# Altium schematic sheet Connectors.SchDoc
size A4; PageSetup: Record=PageOptions|CenterHorizontal=True|CenterVertical=True|PrintScale=1.00|XCorrection=1.00|YCorrection=1.00|PrintKind=0|BorderSize=5000000|LeftOffset=0|BottomOffset=0|Orientation=2|PaperLength=1000|PaperWidth=1000|Scale=100|PaperSource=7|PrintQuality=-3|MediaType=1|DitherType=10|PrintScaleMode=1|PaperKind=A4|PaperIndex=9
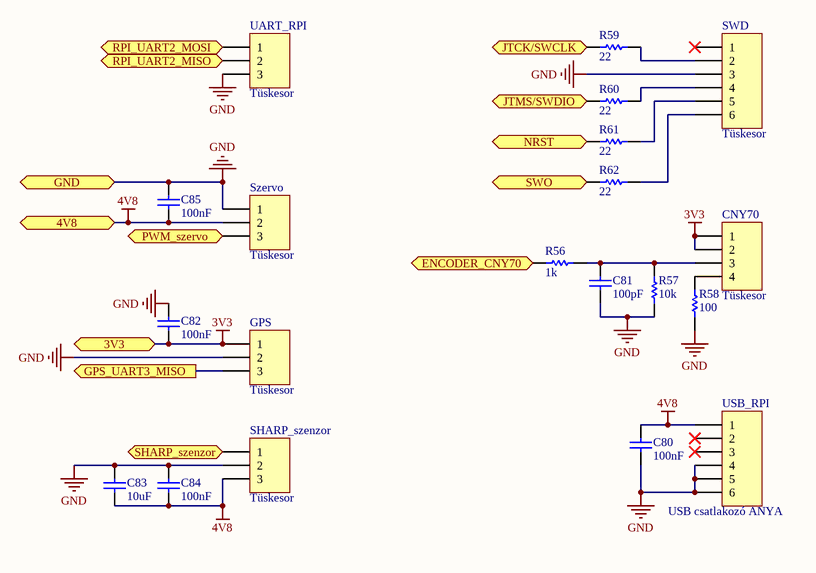
[diagram p0: Connectors.SchDoc]

## Parts
C80  value 100nF  [FP_0603_CAP_080]  (hidden comment: Cap)
C81  value 100pF  [FP_0603_CAP_080]  (hidden comment: Cap)
C82  value 100nF  [FP_0603_CAP_080]  (hidden comment: Cap)
C83  value 10uF  [FP_1206_CAP_125]  (hidden comment: Cap)
C84  value 100nF  [FP_0603_CAP_080]  (hidden comment: Cap)
C85  value 100nF  [FP_0603_CAP_080]  (hidden comment: Cap)
CNY70  Tüskesor  [FP_CONN4_TUSKE_254MM]
GPS  Tüskesor  [FP_CONN3_TUSKE_254MM]
R56  value 1k  [FP_0603_RES]  (hidden comment: Res1)
R57  value 10k  [FP_0603_RES]  (hidden comment: Res1)
R58  value 100  [FP_0603_RES]  (hidden comment: Res1)
R59  value 22  [FP_0603_RES]  (hidden comment: Res1)
R60  value 22  [FP_0603_RES]  (hidden comment: Res1)
R61  value 22  [FP_0603_RES]  (hidden comment: Res1)
R62  value 22  [FP_0603_RES]  (hidden comment: Res1)
SHARP_szenzor  Tüskesor  [HDR1X3]
SWD  Tüskesor  [HDR1X6]
Szervo  Tüskesor  [FP_CONN3_TUSKE_254MM]
UART_RPI  Tüskesor  [FP_CONN3_TUSKE_254MM]
USB_RPI  USB csatlakozó ANYA  [USB_vertical]

## Ports
3V3, 4V8, ENCODER_CNY70 (out), GND, GPS_UART3_MISO (out), JTCK/SWCLK (bidir), JTMS/SWDIO (bidir), NRST (bidir), PWM_szervo (in), RPI_UART2_MISO (out), RPI_UART2_MOSI (in), SHARP_szenzor (out), SWO (bidir)

## Nets
3V3: C82.1 CNY70.1 CNY70.2 GPS.1 ; port 3V3
4V8: C80.2 C83.2 C84.1 C85.1 SHARP_szenzor.3 Szervo.2 USB_RPI.1 ; port 4V8
GND: C80.1 C81.1 C82.2 C83.1 C84.2 C85.2 GPS.2 R57.1 R58.1 SHARP_szenzor.2 SWD.3 Szervo.1 UART_RPI.3 USB_RPI.4 USB_RPI.5 USB_RPI.6 ; port GND
ENCODER_CNY70: R56.2 ; port ENCODER_CNY70
GPS_UART3_MISO: GPS.3 ; port GPS_UART3_MISO
JTCK/SWCLK: R59.2 ; port JTCK/SWCLK
JTMS/SWDIO: R60.2 ; port JTMS/SWDIO
NRST: R61.2 ; port NRST
PWM_szervo: Szervo.3 ; port PWM_szervo
RPI_UART2_MISO: UART_RPI.2 ; port RPI_UART2_MISO
RPI_UART2_MOSI: UART_RPI.1 ; port RPI_UART2_MOSI
SHARP_szenzor: SHARP_szenzor.1 ; port SHARP_szenzor
SWO: R62.2 ; port SWO
NetC81_2: C81.2 CNY70.3 R56.1 R57.2
NetCNY70_4: CNY70.4 R58.2
NetR59_1: R59.1 SWD.2
NetR60_1: R60.1 SWD.4
NetR61_1: R61.1 SWD.5
NetR62_1: R62.1 SWD.6

Not connected (* = marked no-connect by the designer): SWD 1*; USB_RPI 2* 3*

## Library data of the parts
C80-C85 = Cap: Capacitor; Published: 8-Jun-2000; LatestRevisionDate: 17-Jul-2002; LatestRevisionNote: Re-released for DXP Platform.; PackageReference: RAD-0.3; Publisher: Altium Limited; PackageDescription: Radial Cap, Thru-Hole; 2 Leads; 0.3 in Pin Spacing
CNY70 = Header 4: Header, 4-Pin; LatestRevisionDate: 17-Jul-2002; LatestRevisionNote: Re-released for DXP Platform.; Publisher: Altium Limited
GPS SHARP_szenzor Szervo UART_RPI = Header 3: Header, 3-Pin; LatestRevisionDate: 17-Jul-2002; LatestRevisionNote: Re-released for DXP Platform.; Publisher: Altium Limited
R56-R62 = Res1: Resistor; Published: 8-Jun-2000; LatestRevisionDate: 17-Jul-2002; LatestRevisionNote: Re-released for DXP Platform.; PackageReference: AXIAL-0.3; Publisher: Altium Limited; PackageDescription: Axial Device, Thru-Hole; 2 Leads; 0.3 in Pin Spacing
SWD USB_RPI = Header 6: Header, 6-Pin; LatestRevisionDate: 17-Jul-2002; LatestRevisionNote: Re-released for DXP Platform.; Publisher: Altium Limited